# Altium schematic sheet IOexpander.SchDoc: ClickBoard - IO
size Letter; ApprovedBy: K.C.; Author: Antoine Perron; Organization: Cegep Limoilou; Address1: 1300, 8e Avenue; Address2: Québec, QC; Address3: Canada; Address4: G1J 5L5; Revision: B3; SheetNumber: 5; SheetTotal: 5
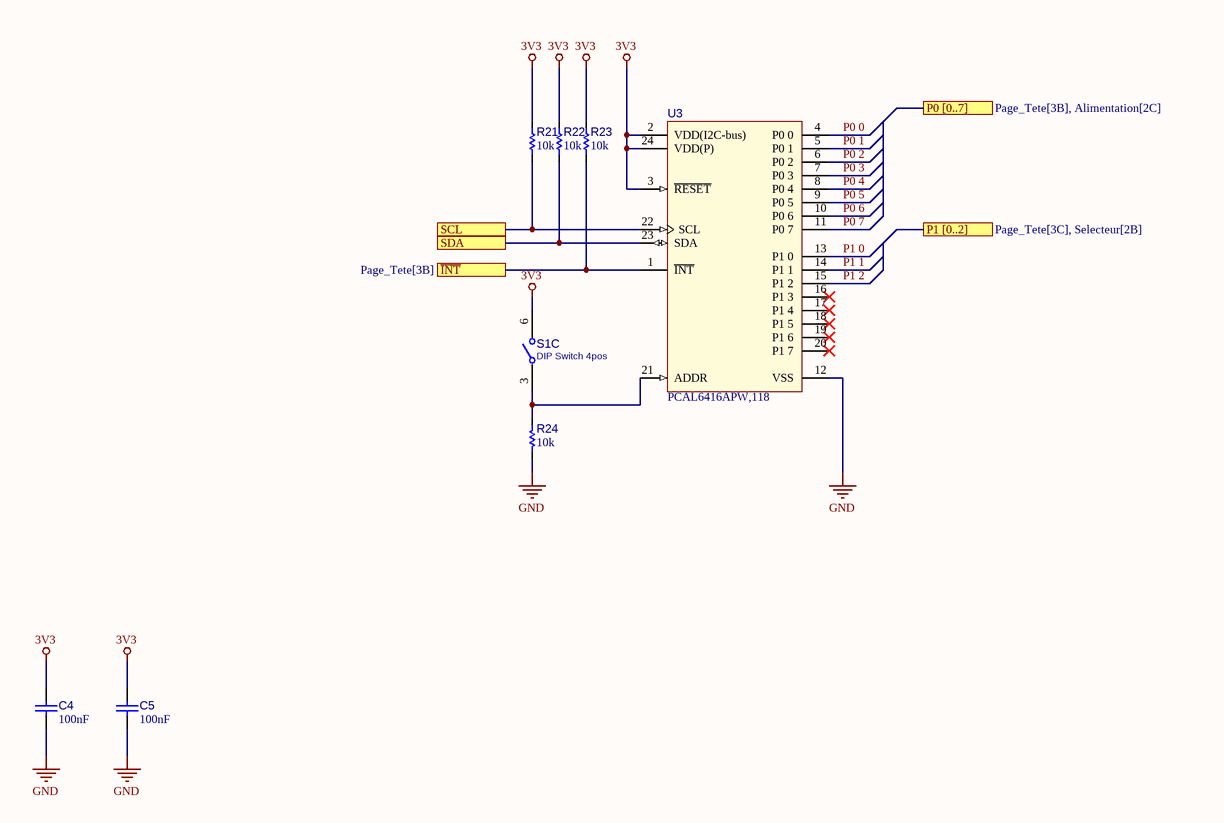
[diagram p0: IOexpander.SchDoc]

## Parts
C4  value 100nF  [C_1608[0603]]  (hidden comment: CAP CER 100nF 50V 0603)
C5  value 100nF  [C_1608[0603]]  (hidden comment: CAP CER 100nF 50V 0603)
R21  value 10k  [R_1608[0603]]  (hidden comment: Res 10k 1% 0603)
R22  value 10k  [R_1608[0603]]  (hidden comment: Res 10k 1% 0603)
R23  value 10k  [R_1608[0603]]  (hidden comment: Res 10k 1% 0603)
R24  value 10k  [R_1608[0603]]  (hidden comment: Res 10k 1% 0603)
S1  value DIP Switch 4pos  [S_DIP_SWITCH_50MIL_4POS]  (hidden comment: DSHP04TSGER)  (part C of 4)
U3  PCAL6416APW,118  [U_TSSOP24_SOT355-1-IPC_B]

## Ports
P0 [0..7] (see Page_Tete[3B], Alimentation[2C]), P1 [0..2] (see Page_Tete[3C], Selecteur[2B]), SCL (see Page_Tete[3B], ADC[3B], Alimentation[4B]), SDA (see Page_Tete[3B], ADC[3B], Alimentation[4B]), ~{INT} (see Page_Tete[3B])

## Nets
3V3: C4.2 C5.2 R21.2 R22.2 R23.2 S1.6 U3.2(VDD(I2C-bus)) U3.3(~{RESET}) U3.24(VDD(P))
GND: C4.1 C5.1 R24.1 U3.12(VSS)
~{INT}: R23.1 U3.1(~{INT}) ; port ~{INT}
P0 0: U3.4(P0_0)
P0 1: U3.5(P0_1)
P0 2: U3.6(P0_2)
P0 3: U3.7(P0_3)
P0 4: U3.8(P0_4)
P0 5: U3.9(P0_5)
P0 6: U3.10(P0_6)
P0 7: U3.11(P0_7)
P1 0: U3.13(P1_0)
P1 1: U3.14(P1_1)
P1 2: U3.15(P1_2)
SCL: R21.1 U3.22(SCL) ; port SCL
SDA: R22.1 U3.23(SDA) ; port SDA
NetR24_2: R24.2 S1.3 U3.21(ADDR)

Not connected (* = marked no-connect by the designer): U3 16(P1_3)* 17(P1_4)* 18(P1_5)* 19(P1_6)* 20(P1_7)*

## Notes on the sheet
- Titre :
- Conception :
- Date :
- Approbation :
- Heure :
- Révision :
- Feuille
- de
- Fichier :

## Library data of the parts
C4 C5 = CAP002: Capacitor type 1; Manufacturer 1: Yageo; Manufacturer Part Number 1: CC0603KRX7R9BB104; LibRef: CAP002; Code CEGEP: COND0143SM; Tolerance: 10%; Dielectric: X7R; Rated Voltage: 50V; Mounting Technology: SMT; Supplier 1: LCSC; Supplier Part Number 1: C14663
R21-R24 = RES001: Resistor type 1; Manufacturer 1: Yageo; Manufacturer Part Number 1: RC0603FR-0710KL; LibRef: RES001; Code CEGEP: RESI0238-0603; Puissance: 1/10W; Max Working Voltage: 75V; Tolerance: 1%; Mounting Technology: SMT; Supplier 1: LCSC; Supplier Part Number 1: C98220
S1 = SW_DIP_50MIL_4POS: SWITCH DIP SLIDE SPST 25MA 24V, pitch 1.27mm, height 1.55mm; Manufacturer 1: kangshen; Manufacturer 2: Omron; Manufacturer Part Number 1: DSHP04TSGER; Manufacturer Part Number 2: A6H-4102-PM; Mounting Technology: SMT; Supplier 1: LCSC; Supplier 2: LCSC; Supplier Part Number 1: C3293144; Supplier Part Number 2: C2733274; Supplier 3: Digikey; Supplier Part Number 3: 39-A6H-4102-PMCT-ND
U3 = U_PCAL6416APW: IC I/O EXPANDER 16BIT 24TSSOP; Manufacturer Part Number 1: TCA6416APWR; Manufacturer 1: Texas Instruments; Manufacturer 2: NXP Semiconductors; Manufacturer Part Number 2: PCAL6416APW,118; Mounting Technology: SMT; Supplier 1: LCSC; Supplier 2: LCSC; Supplier 3: Digikey; Supplier Part Number 1: C130203; Supplier Part Number 2: C2652299; Supplier Part Number 3: 568-9922-1-ND